# EAGLE design PCB_CoLAB_Schematic_V2 (EAGLE 9.6.2)
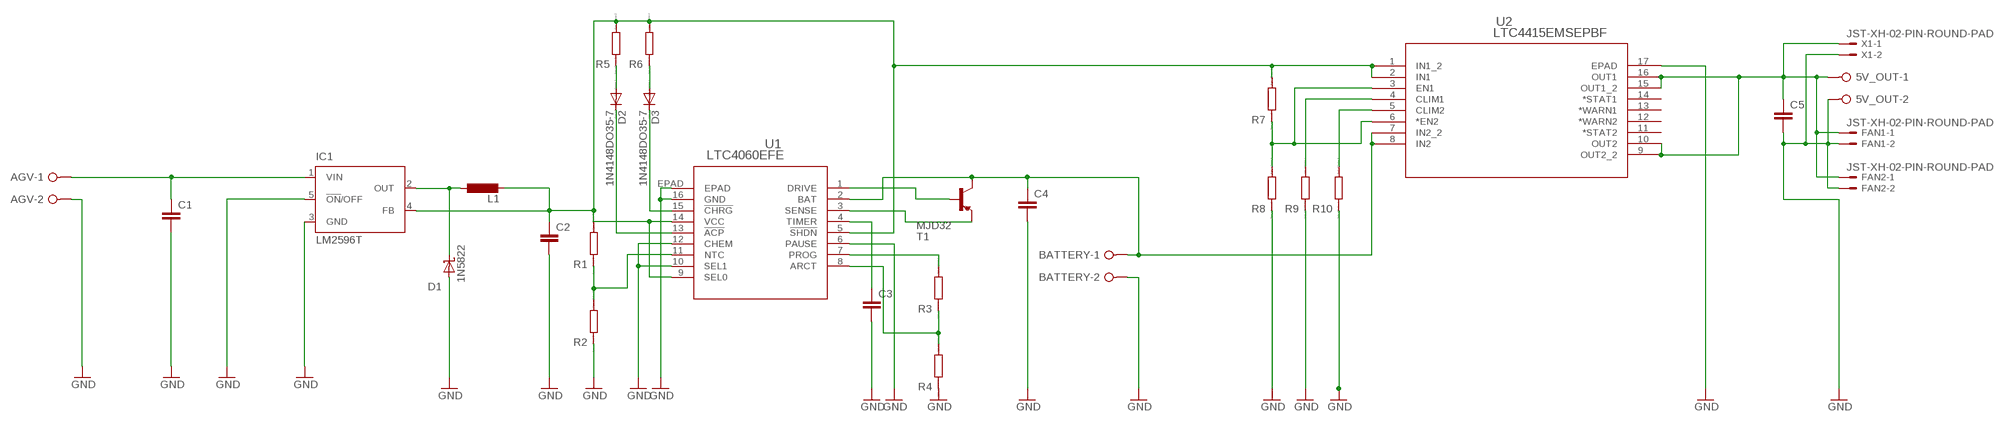
[diagram p0: schematic, sheet 1]

## Parts
5V_OUT  W237-02P  [W237-132]
AGV  W237-02P  [W237-132]
BATTERY  W237-02P  [W237-132]
C1  C-EU025-024X044  [C025-024X044]
C2  C-EU025-024X044  [C025-024X044]
C3  C-EU025-024X044  [C025-024X044]
C4  C-EU025-024X044  [C025-024X044]
C5  C-EU025-024X044  [C025-024X044]
D1  1N5822  [DIOAD2120W130L950D530P]
D2  1N4148DO35-7  [DO35-7]
D3  1N4148DO35-7  [DO35-7]
FAN1  JST-XH-02-PIN-ROUND-PAD  [JST-XH-02-PACKAGE-ROUND-PAD]
FAN2  JST-XH-02-PIN-ROUND-PAD  [JST-XH-02-PACKAGE-ROUND-PAD]
IC1  LM2596T  [T05D]
L1  L-EU0204/7  [0204/7]
R1  R0204/7  [0204/7]
R2  R0204/7  [0204/7]
R3  R0204/7  [0204/7]
R4  R0204/7  [0204/7]
R5  R0204/7  [0204/7]
R6  R0204/7  [0204/7]
R7  R0204/7  [0204/7]
R8  R0204/7  [0204/7]
R9  R0204/7  [0204/7]
R10  R0204/7  [0204/7]
T1  MJD32  [DPAK]
U1  LTC4060EFE  [TSSOP-16_FE/BC_LIT]
U2  LTC4415EMSEPBF  [MSOP-16_MSE]
X1  JST-XH-02-PIN-ROUND-PAD  [JST-XH-02-PACKAGE-ROUND-PAD]

## Nets
GND: 5V_OUT.2 AGV.2 BATTERY.2 C1.2 C2.2 C3.2 C4.2 C5.2 D1.A FAN1.2 FAN2.2 IC1.3(GND) IC1.5(!ON!/OFF) R2.1 R4.1 R8.1 R9.1 R10.1 U1.6(PAUSE) U1.10(SEL1) U1.12(CHEM) U1.16(GND) U1.EPAD U2.17(EPAD) X1.2
N$1: R3.2 U1.7(PROG)
N$2: AGV.1 C1.1 IC1.1(VIN)
N$3: D1.C IC1.2(OUT) L1.1
N$4: R1.1 R2.2 U1.11(NTC)
N$5: R7.1 R8.2 U2.3(EN1) U2.6(*EN2)
N$6: R3.1 R4.2 U1.8(ARCT)
N$7: T1.3(E) U1.3(SENSE)
N$8: T1.1(B) U1.1(DRIVE)
N$9: C2.1 IC1.4(FB) L1.2 R1.2 R5.2 R6.2 R7.2 U1.5(!SHDN) U1.9(SEL0) U1.14(VCC) U2.1(IN1_2) U2.2(IN1)
N$11: C3.1 U1.4(TIMER)
N$12: D2.A R5.1
N$13: D2.C U1.13(!ACP)
N$14: D3.C U1.15(!CHRG)
N$15: D3.A R6.1
N$16: BATTERY.1 C4.1 T1.4(C) U1.2(BAT) U2.7(IN2_2) U2.8(IN2)
N$17: R9.2 U2.4(CLIM1)
N$18: R10.2 U2.5(CLIM2)
N$19: 5V_OUT.1 C5.1 FAN1.1 FAN2.1 U2.9(OUT2_2) U2.10(OUT2) U2.15(OUT1_2) U2.16(OUT1) X1.1
Unconnected: U2.11(*STAT2) U2.12(*WARN2) U2.13(*WARN1) U2.14(*STAT1)

## Library data of the parts
5V_OUT AGV BATTERY = con-wago-508:W237-02P: WAGO SREW CLAMP; OC_FARNELL: unknown; OC_NEWARK: unknown
C1-C5 = rcl:C-EU: CAPACITOR, European symbol
D1 = 1N5822:1N5822: 1N5822 Series 40 V 3 A Through Hole Schottky Rectifier - DO-201AD Check prices <https://pricing.snapeda.com/parts/1N5822/ON%20Semiconductor/view-part?ref=eda>; AVAILABILITY: Good; DESCRIPTION: Diode Schottky 40V 3A Through Hole DO-201AD; MF: ON Semiconductor; MP: 1N5822; PACKAGE: AXIAL LEAD-2 ON Semiconductor; PRICE: None; PURCHASE-URL: https://pricing.snapeda.com/search/part/1N5822/?ref=eda
D2 D3 = diode:1N4148: DIODE high speed (Philips)
FAN1 FAN2 X1 = Rembrandt Electronics - JST XH Connectors v1-0:JST-XH-02-PIN: JST XH Connector 2 Pin Wire to board connector. Pitch: 2,54 mm, (0.100") Number of pins: 2 Created by Rembrandt Electronics www.rembrandtelectronics.com
IC1 = national-semiconductor:LM2596: SIMPLE SWITCHER® Power Converter 150 kHz 3A Step-Down Voltage Regulator Source: http://www.national.com/ds/LM/LM2596.pdf; MPN: LM2596T-ADJ/LF02; OC_FARNELL: 9494162; OC_NEWARK: 65K5910
L1 = rcl:L-EU: INDUCTOR, European symbol
R1-R10 = eagle-ltspice:R: RESISTOR, European symbol; SPICEMODEL: NONE; SPICEPREFIX: R
T1 = transistor:MJD32*: Complementary Power Transistors
U1 = LTC4060:LTC4060EFE; BUILT_BY: EMA_UL_Team; MANUFACTURER_PART_NUMBER: LTC4060EFE; SOURCELIBRARY: LinearTech_2016-05-13_9; VENDOR: Linear Technology
U2 = LTC4415EMSEPBF:LTC4415EMSEPBF: Check prices <https://pricing.snapeda.com/parts/LTC4415EMSE%23PBF/Analog%20Devices/view-part?ref=eda>; AVAILABILITY: Warning; DESCRIPTION: OR Controller Source Selector Switch P-Channel 2:2 16-MSOP-EP; MF: Analog Devices; MP: LTC4415EMSE#PBF; PACKAGE: MSOP -16 Analog Devices; PRICE: None; PURCHASE-URL: https://pricing.snapeda.com/search/part/LTC4415EMSE#PBF/?ref=eda

## Board
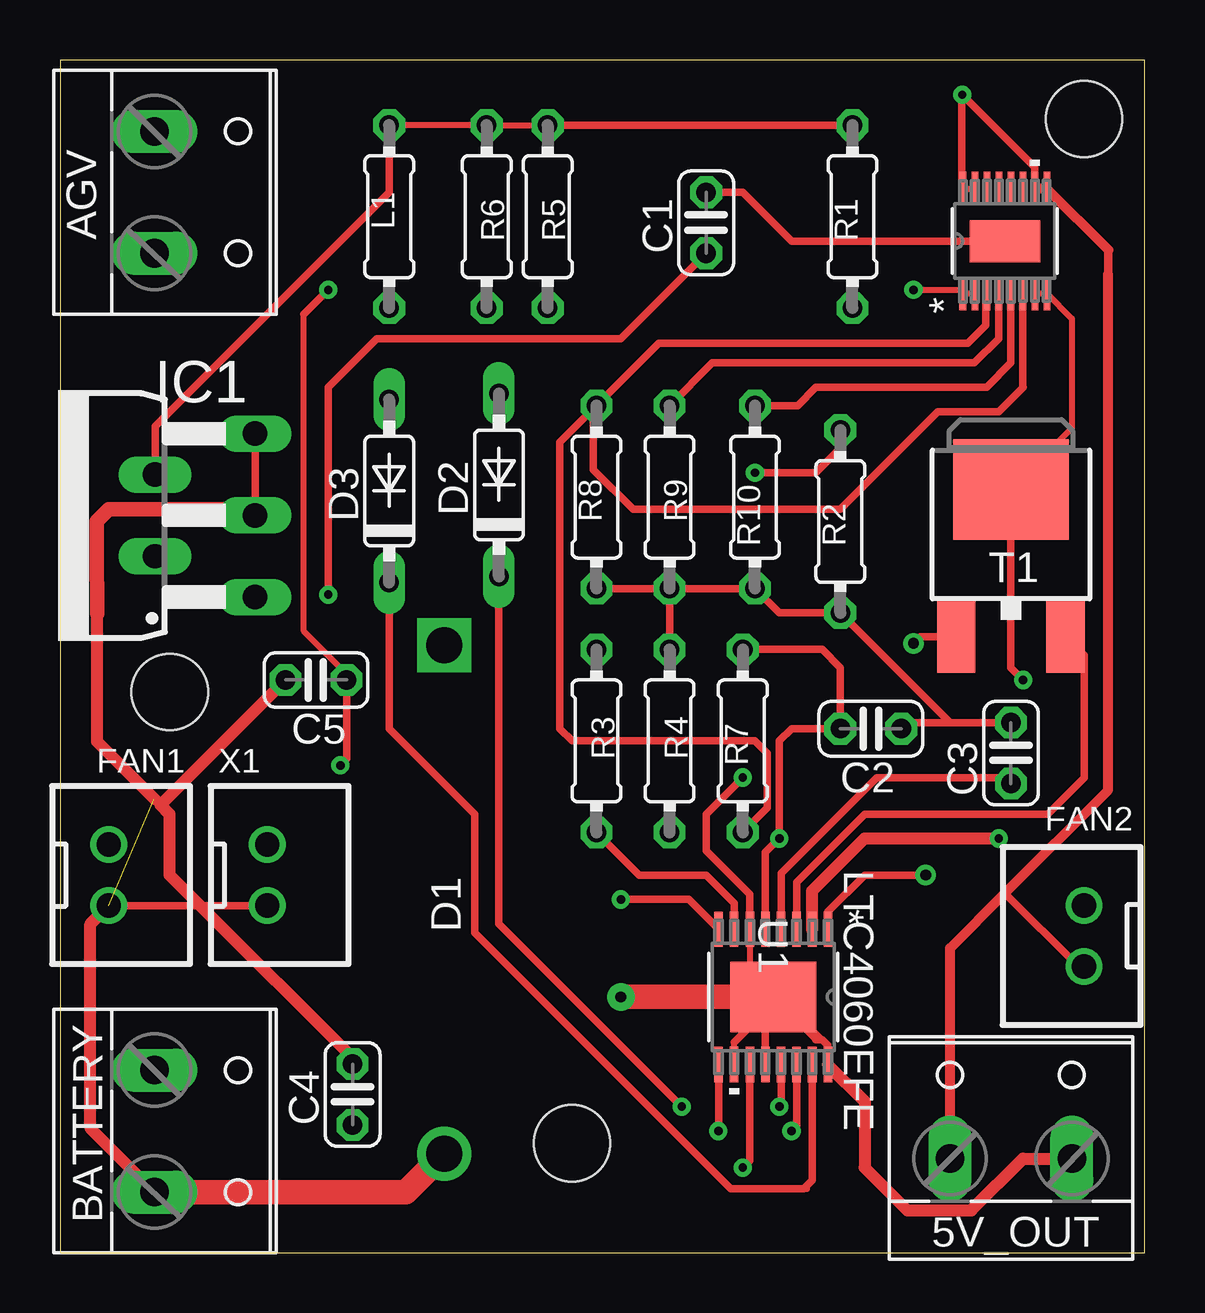
[diagram p1: board, top side]
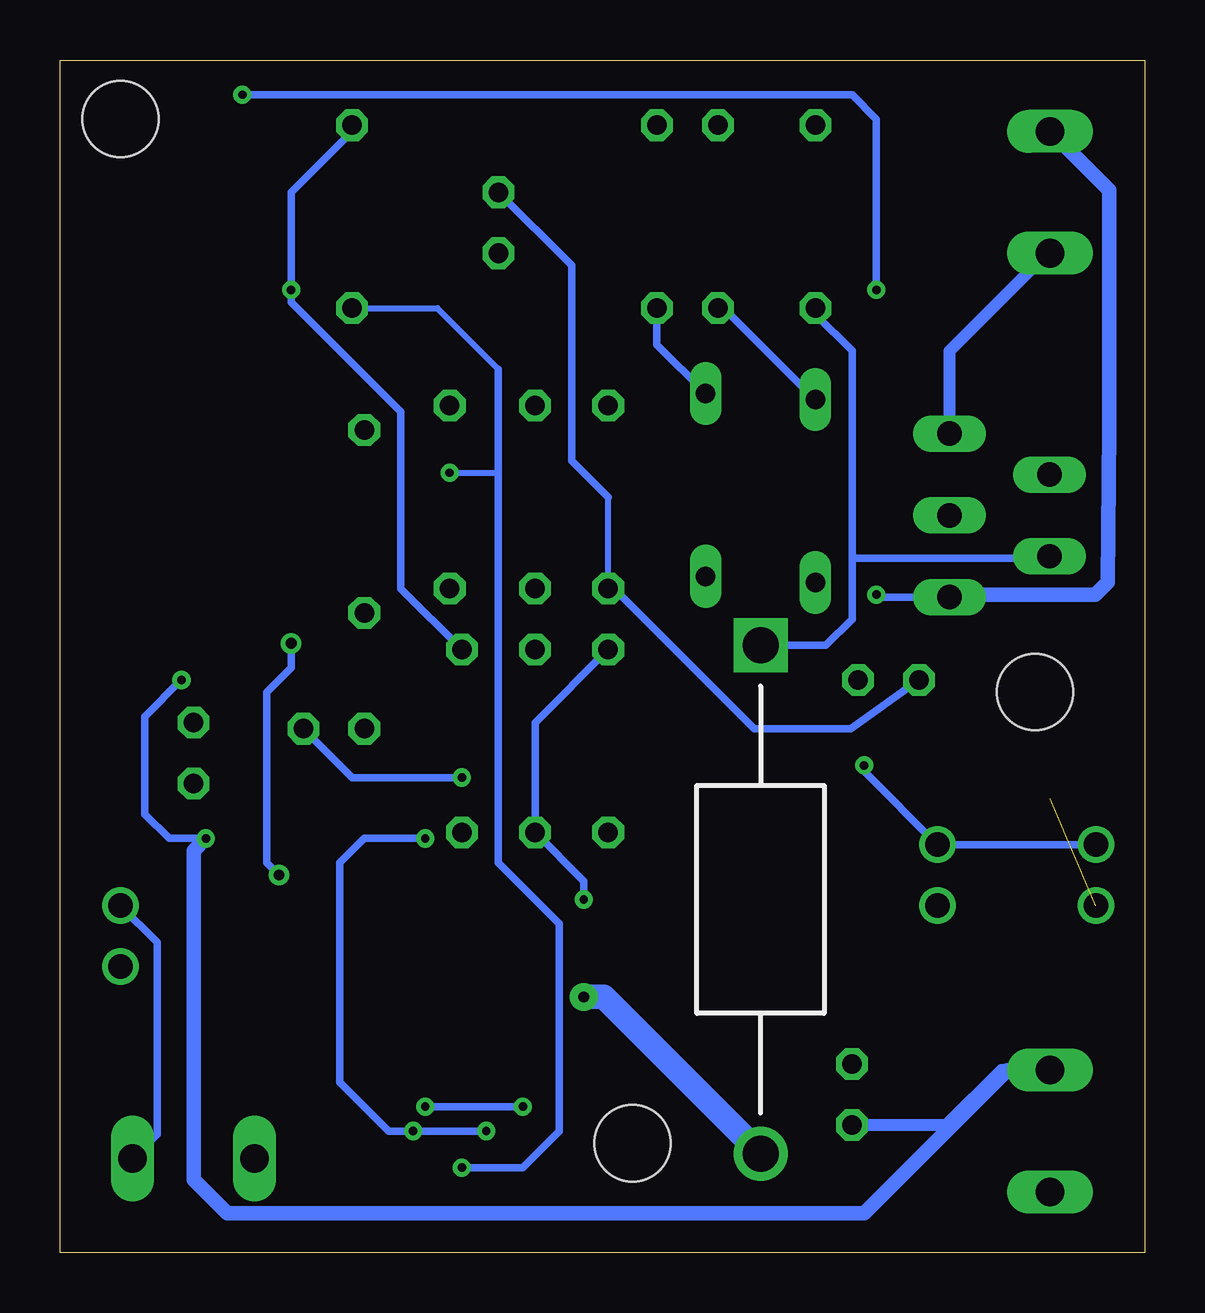
[diagram p2: board, bottom side, seen from below]

Size 45.19 x 49.71 mm. Coordinates in mm from the lower left corner, seen from the top.
Outline: 0,0 45.19,0 45.19,49.71 0,49.71 0,0
Copper layers (1*16): Top 0.035mm / dielectric 1.5mm / Bottom 0.035mm
Design rules "default": minimum track width 6mil, minimum drill 0.35mm, track to track 6mil, track to pad 6mil, pad to pad 6mil, via to via 6mil, smd to smd 6mil, copper to edge 40mil, drill to drill 6mil, minimum pad ring 10mil, minimum via ring 8mil, stop-mask expansion 4mil, vias tented up to drill 0mil, thermal gap 10mil
Holes 3.17 mm at 4.57,23.37 42.67,47.24 21.34,4.57

### Footprints (pad centres in the part's own frame; a part is rotated, then mirrored left to right if it is on the bottom)
W237-132 = drill 1.194 long: 1 -2.54,-0.635; 2 2.54,-0.635
C025-024X044 = drill 0.813 octagon: 1 -1.27,0; 2 1.27,0
DIOAD2120W130L950D530P = drill 1.5 pad 2.25: A 10.6,0 | drill 1.5 pad 2.25 square: C -10.6,0
DO35-7 = drill 0.813 long: A 3.81,0; C -3.81,0
JST-XH-02-PACKAGE-ROUND-PAD = drill 1.016: 1 -1.27,0; 2 1.27,0
T05D = drill 1.016 long: 1 -3.404,-5.08; 2 -1.702,-0.914; 3 0,-5.08; 4 1.702,-0.914; 5 3.404,-5.08
0204/7 = drill 0.813 octagon: 1 -3.81,0; 2 3.81,0
DPAK = smd 1.6 x 3: 1 -2.28,-4.04; 3 2.28,-4.04 | smd 4.826 x 4.191: 4 0,2.096
TSSOP-16_FE/BC_LIT = smd 1.473 x 0.356: 1 -2.819,2.276; 2 -2.819,1.626; 3 -2.819,0.975; 4 -2.819,0.325; 5 -2.819,-0.325; 6 -2.819,-0.975; 7 -2.819,-1.626; 8 -2.819,-2.276; 9 2.819,-2.276; 10 2.819,-1.626; 11 2.819,-0.975; 12 2.819,-0.325; 13 2.819,0.325; 14 2.819,0.975; 15 2.819,1.626; 16 2.819,2.276 | smd 2.946 x 3.581: EPAD 0,0
MSOP-16_MSE = smd 1.397 x 0.279: 1 -2.184,1.751; 2 -2.184,1.251; 3 -2.184,0.751; 4 -2.184,0.25; 5 -2.184,-0.25; 6 -2.184,-0.751; 7 -2.184,-1.251; 8 -2.184,-1.751; 9 2.184,-1.751; 10 2.184,-1.251; 11 2.184,-0.751; 12 2.184,-0.25; 13 2.184,0.25; 14 2.184,0.751; 15 2.184,1.251; 16 2.184,1.751 | smd 1.753 x 2.946: 17 0,0

### Placement (x,y rotation side)
5V_OUT  39.62,4.57 0 top
AGV  4.57,44.2 270 top
BATTERY  4.57,5.08 270 top
C1  26.92,42.93 90 top
C2  33.78,21.84 0 top
C3  39.62,20.83 90 top
C4  12.19,6.6 90 top
C5  10.67,23.88 180 top
D1  16,14.73 270 bottom
D2  18.29,32 90 top
D3  13.72,31.75 90 top
FAN1  2.03,15.75 270 top
FAN2  42.67,13.21 90 top
IC1  3.05,30.73 90 top
L1  13.72,43.18 90 top
R1  33.02,43.18 90 top
R2  32.51,30.48 90 top
R3  22.35,21.34 270 top
R4  25.4,21.34 270 top
R5  20.32,43.18 90 top
R6  17.78,43.18 90 top
R7  28.45,21.34 90 top
R8  22.35,31.5 90 top
R9  25.4,31.5 90 top
R10  28.96,31.5 90 top
T1  39.62,29.72 0 top
U1  29.72,10.67 270 top
U2  39.37,42.16 90 top
X1  8.64,15.75 270 top

### Tracks (layer width: path | path; a pad name or v marks a point on that pad's centre or on a via)
GND  (via drill 0.35, 0.45 pad 1.15)  (1 unrouted)
  Top 0.254: C3.2 39.37,22.35 | 39.37,42.93 U2.17 | 29.46,7.78 U1.12 | U1.10 28.09,8.79 | U1.EPAD 29.72,10.41 29.39,10.09 | U1.16 31.99,8.65 | 30.48,10.16 31.75,8.89 | U1.6 28.74,11.9 | 28.74,11.9 28.96,11.68 | 28.74,11.9 28.74,11.64 U1.EPAD | 31.5,8.89 U1.EPAD
  Top 0.305: R9.1 R10.1 29.97,26.67 R2.1 37.08,22.1 C3.2 35.31,22.1 C2.2 | R9.1 R8.1 | v28.45,19.81 26.92,18.29 26.92,16.76 28.74,14.95 U1.6 | R9.1 R4.1 | IC1.5 IC1.3 | C1.2 28.45,44.2 30.48,42.16 U2.17 | 28.09,8.79 29.39,10.09 U1.12 | 31.99,8.65 31.75,8.89 31.5,8.89 | FAN1.2 5.84,14.48 X1.2
  Top 0.508: 5V_OUT.2 40.13,3.94 37.97,1.78 35.31,1.78 33.53,3.56 33.53,6.31 U1.16 | 1.55,26.64 1.55,21.31 3.94,18.92 | BATTERY.2 1.27,5.21 1.27,13.72 FAN1.2 | C4.2 12.19,8.13 5.84,14.48 4.57,15.75 4.57,18.29 4.19,18.67 C5.2
  Top 0.61: 1.55,26.64 1.52,29.32 1.52,30.48 2.03,30.99 7.87,30.99 IC1.3
  Top 1.016: D1.A 14.41,2.54 BATTERY.2 | v23.37,10.67 29.46,10.67 29.72,10.41
  Bottom 0.254: 22.35,31.5 R8.1 22.1,27.69
  Bottom 0.305: 28.96,19.81 v28.45,19.81 33.02,19.81 C2.2 | 22.35,31.5 23.88,33.02 23.88,41.15 C1.2 | C5.2 12.24,21.84 16.26,21.84 22.1,27.69 | FAN2.2 41.15,12.95 41.15,4.95 5V_OUT.2
  Bottom 0.508: IC1.5 8.13,37.59 4.06,41.66 AGV.2
  Bottom 1.016: D1.A 22.54,10.67 v23.37,10.67
N$1
  Top 0.305: U1.7 28.09,14.58 26.92,15.75 24.13,15.75 R3.2
N$2  (via drill 0.35)
  Top 0.305: C1.1 23.37,38.1 13.21,38.1 11.18,36.07 v11.18,27.43
  Bottom 0.254: v11.18,27.43 11.07,27.33
  Bottom 0.305: 11.07,27.33 IC1.1
  Bottom 0.61: IC1.1 8.03,27.43 2.05,27.43 1.54,27.94 1.47,34.29 1.47,44.27 AGV.1
N$3
  Top 0.254: 13.46,39.12 L1.1
  Bottom 0.254: 13.46,39.12 L1.1 | 12.12,29.03 12.19,28.96
  Bottom 0.305: L1.1 13.72,39.12 12.19,37.59 12.19,28.96 | 12.19,28.96 12.19,26.42 13.28,25.33 D1.C | 12.19,28.96 4.04,28.96 IC1.2
N$4  (via drill 0.35)
  Top 0.254: 28.74,3.85 v28.45,3.56
  Top 0.305: U1.11 28.74,3.85 | R2.2 32.51,33.53 31.5,32.51 v28.96,32.51
  Bottom 0.254: R1.1 29.46,39.37 26.92,36.83 | v28.96,32.51 26.92,32.51
  Bottom 0.305: v28.45,3.56 25.91,3.56 24.38,5.08 24.38,13.72 26.92,16.26 26.92,32.51 26.92,36.83
N$5
  Top 0.254: 22.22,35.18 R8.2
  Top 0.305: R8.2 24.94,37.9 37.81,37.9 38.56,38.65 38.56,39.92 U2.3 | R7.1 29.46,18.54 29.46,20.83 28.96,21.34 21.34,21.34 20.83,21.84 20.83,33.78 22.22,35.18 22.22,32.64 23.88,30.99 32.51,30.99 36.58,35.05 39.12,35.05 40.13,36.07 40.12,36.08 U2.6
N$6  (via drill 0.35)
  Top 0.305: U1.8 26.2,14.73 v23.37,14.73
  Bottom 0.305: v23.37,14.73 23.37,15.49 R4.2 25.4,22.1 R3.1
N$7
  Top 0.305: U1.3 30.69,15.45 33.53,18.29 41.15,18.29 42.67,19.81 42.67,24.91 T1.3
N$8  (via drill 0.45)
  Top 0.254: T1.1 37.59,25.43
  Top 0.305: U1.1 31.99,14.21 33.53,15.75 v36.07,15.75 | T1.1 35.84,25.68 v35.56,25.4
  Bottom 0.305: v35.56,25.4 35.56,24.38 36.58,23.37 36.58,16.26 v36.07,15.75
N$9  (via drill 0.35)
  Top 0.254: R5.2 R6.2 L1.2 | v35.56,40.13 37.47,40.13 U2.1 U2.2 | v27.44,5.09 v27.43,5.08 | 30.69,5.29 v30.48,5.08
  Top 0.305: U1.5 29.39,16.69 v29.97,17.27 29.97,21.34 30.48,21.84 C2.1 32.51,24.38 31.75,25.15 R7.2 | R1.2 R5.2 | U1.9 v27.44,5.09 | U1.14 30.69,5.29 | IC1.4 3.96,34.44 13.72,44.2 L1.2
  Bottom 0.305: R7.2 30.99,27.69 30.99,35.05 35.56,39.62 v35.56,40.13 35.56,44.2 33.02,46.74 R1.2 | v27.43,5.08 v30.48,5.08 31.5,5.08 33.53,7.11 33.53,16.26 32.51,17.27 v29.97,17.27
N$11
  Top 0.254: C3.1 39.37,19.81
  Top 0.305: 39.37,19.81 34.04,19.81 30.04,15.82 U1.4
N$12
  Bottom 0.305: R5.1 20.32,37.85 D2.A
N$13  (via drill 0.35)
  Top 0.254: 30.04,6.17 v29.97,6.1
  Top 0.305: U1.13 30.04,6.17 | v25.91,6.1 18.29,13.72 D2.C
  Bottom 0.305: v29.97,6.1 v25.91,6.1
N$14
  Top 0.254: 30.99,2.67 31.12,2.67
  Top 0.305: D3.C 13.72,21.84 17.27,18.29 17.27,13.34 27.94,2.67 30.99,2.67 31.34,3.02 U1.15
N$15
  Bottom 0.305: R6.1 17.53,39.37 D3.A
N$16  (via drill 0.35)
  Top 0.254: U2.7 U2.8 42.16,38.94 42.16,34.35 T1.4
  Top 0.305: v40.13,23.88 39.62,24.38 T1.4
  Top 0.508: U1.2 31.34,15.09 33.53,17.27 v39.12,17.27
  Bottom 0.254: C4.1 11.81,5.71
  Bottom 0.305: v39.12,17.27 40.64,17.27 41.66,18.29 41.66,22.35 v40.13,23.88
  Bottom 0.508: C4.1 8.25,5.33 5.97,7.62 BATTERY.1
  Bottom 0.61: v39.12,17.27 39.62,16.76 39.62,3.05 38.23,1.65 11.68,1.65 5.71,7.62 BATTERY.1
N$17
  Top 0.305: R9.2 27.18,37.08 38.1,37.08 39.12,38.1 U2.4
N$18
  Top 0.305: R10.2 30.73,35.31 31.5,36.07 38.61,36.07 39.62,37.08 U2.5
N$19  (via drill 0.35)
  Top 0.254: U2.16 U2.15 | 41.15,44.38 U2.9 | C5.1 11.94,23.89 11.96,24.11 10.16,25.91 10.16,39.12
  Top 0.305: U2.10 40.62,45.23 v37.59,48.26 37.57,48.24 37.57,44.39 U2.16 | 10.16,39.12 v11.18,40.13 | 43.67,41.76 43.69,41.78 | FAN2.1 42.42,11.94 39.37,14.99 | 11.96,24.11 11.96,20.59 v11.68,20.32
  Top 0.356: 43.67,40.77 43.67,41.76
  Top 0.406: U2.10 U2.9 43.69,41.78 | 5V_OUT.1 37.08,12.7 39.37,14.99 43.67,19.28 43.67,40.77
  Bottom 0.305: v11.18,40.13 11.18,47.24 12.19,48.26 v37.59,48.26 | FAN1.1 X1.1 11.68,20.07 v11.68,20.32